# Altium project EM411-PROJ001.PrjPcb
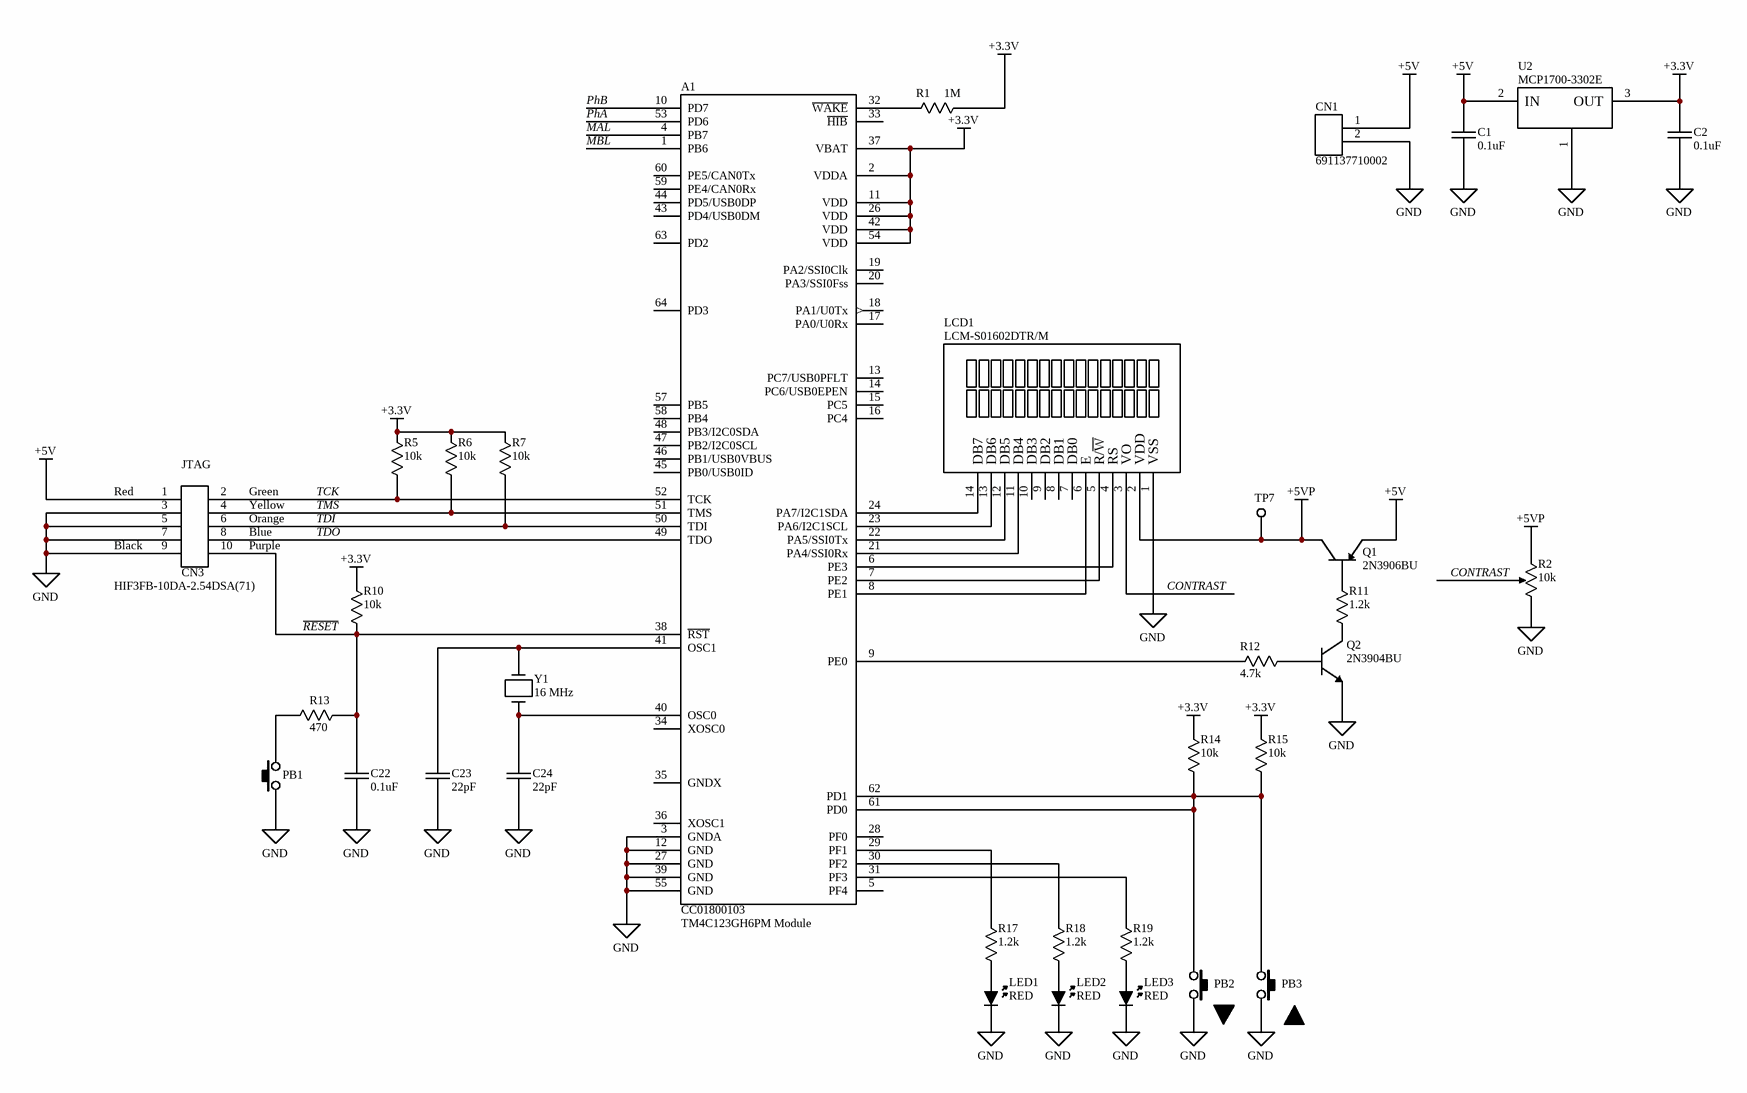
[diagram p0: Sheet1.SchDoc]
3 sheets, 96 parts. Net scope: global (net labels, ports and power ports of the same name join across sheets).
Board file: PCB1.PcbDoc
Sheets:
  Sheet1.SchDoc
  Sheet2.SchDoc
  Sheet3.SchDoc

## Sheet Sheet1.SchDoc: EM411-PROJ001
size A3; Date: March-25-2021; DrawnBy: Gaurav Daura; SheetNumber: 1; SheetTotal: 3

### Parts
A1  CC01800103  Microcontroller: TM4C123GH6PM Module  [CC01800102]
C1  0.1uF  [C320C104M5R5TA]
C2  0.1uF  [C320C104M5R5TA]
C22  0.1uF  [C320C104M5R5TA]
C23  22pF  [K220J15C0GF5TH5]
C24  22pF  [K220J15C0GF5TH5]
CN1  691137710002  [691137710002]
CN3  HIF3FB-10DA-2.54DSA(71)  [HIF3FB-10DA-2.54DSA(71)]
LCD1  LCM-S01602DTR/M  [LCM-S01602DTR/M]
LED1  RED  [C503B-RCN-CW0Z0AA1]
LED2  RED  [C503B-RCN-CW0Z0AA1]
LED3  RED  [C503B-RCN-CW0Z0AA1]
PB1  3-1825910-5  [3-1825910-5]  (value not drawn)
PB2  3-1825910-5  [3-1825910-5]  (value not drawn)
PB3  3-1825910-5  [3-1825910-5]  (value not drawn)
Q1  2N3906BU  [2N3906BU]
Q2  2N3904BU  [2N3904BU]
R1  1M  [1/2WattResistor]
R2  10k  [T93YA103KT20]
R5  10k  [1/2WattResistor]
R6  10k  [1/2WattResistor]
R7  10k  [1/2WattResistor]
R10  10k  [1/2WattResistor]
R11  1.2k  [1/2WattResistor]
R12  4.7k  [1/2WattResistor]
R13  470  [1/2WattResistor]
R14  10k  [1/2WattResistor]
R15  10k  [1/2WattResistor]
R17  1.2k  [1/2WattResistor]
R18  1.2k  [1/2WattResistor]
R19  1.2k  [1/2WattResistor]
TP7  TESTPOINT-2MM  [TESTPOINT-2MM]  (value not drawn)  (no BOM)
U2  MCP1700-3302E  [MCP1700-3302E/TO]
Y1  16 MHz  [ABL-16.000MHZ-B2]

### Nets
+3.3V: A1.2(VDDA) A1.11(VDD) A1.26(VDD) A1.37(VBAT) A1.42(VDD) A1.54(VDD) C2.2 R1.2 R5.2 R6.2 R7.2 R10.2 R14.2 R15.2 U2.3(OUT)
+5V: C1.2 CN1.1 CN3.1 Q1.1(E) U2.2(IN)
+5VP: LCD1.2(VDD) Q1.3(C) R2.1 TP7.1
GND: A1.3(GNDA) A1.12(GND) A1.27(GND) A1.39(GND) A1.55(GND) C1.1 C2.1 C22.2 C23.2 C24.2 CN1.2 CN3.3 CN3.5 CN3.7 CN3.9 LCD1.1(VSS) LED1.K LED2.K LED3.K PB1.1 PB2.2 PB3.2 Q2.1(E) R2.3 U2.1(GND)
CONTRAST: LCD1.3(VO) R2.2
MAL: A1.4(PB7)
MBL: A1.1(PB6)
PhA: A1.53(PD6)
PhB: A1.10(PD7)
~{RESET}: A1.38(~{RST}) C22.1 CN3.10 R10.1 R13.2
TCK: A1.52(TCK) CN3.2 R5.1
TDI: A1.50(TDI) CN3.6 R7.1
TDO: A1.49(TDO) CN3.8
TMS: A1.51(TMS) CN3.4 R6.1
NetA1_6: A1.6(PE3) LCD1.4(RS)
NetA1_7: A1.7(PE2) LCD1.5(R/~{W})
NetA1_8: A1.8(PE1) LCD1.6(E)
NetA1_9: A1.9(PE0) R12.1
NetA1_21: A1.21(PA4/SSI0Rx) LCD1.11(DB4)
NetA1_22: A1.22(PA5/SSI0Tx) LCD1.12(DB5)
NetA1_23: A1.23(PA6/I2C1SCL) LCD1.13(DB6)
NetA1_24: A1.24(PA7/I2C1SDA) LCD1.14(DB7)
NetA1_29: A1.29(PF1) R17.2
NetA1_30: A1.30(PF2) R18.2
NetA1_31: A1.31(PF3) R19.2
NetA1_32: A1.32(~{WAKE}) R1.1
NetA1_40: A1.40(OSC0) C24.1 Y1.1
NetA1_41: A1.41(OSC1) C23.1 Y1.2
NetA1_61: A1.61(PD0) A1.62(PD1) PB2.1 PB3.1 R14.1 R15.1
NetLED1_A: LED1.A R17.1
NetLED2_A: LED2.A R18.1
NetLED3_A: LED3.A R19.1
NetPB1_2: PB1.2 R13.1
NetQ1_2: Q1.2(B) R11.2
NetQ2_2: Q2.2(B) R12.2
NetQ2_3: Q2.3(C) R11.1

Not connected (* = marked no-connect by the designer): A1 5(PF4) 13(PC7/USB0PFLT) 14(PC6/USB0EPEN) 15(PC5) 16(PC4) 17(PA0/U0Rx) 18(PA1/U0Tx) 19(PA2/SSI0Clk) 20(PA3/SSI0Fss) 28(PF0) 33(~{HIB}) 34(XOSC0) 35(GNDX) 36(XOSC1) 43(PD4/USB0DM) 44(PD5/USB0DP) 45(PB0/USB0ID) 46(PB1/USB0VBUS) 47(PB2/I2C0SCL) 48(PB3/I2C0SDA) 57(PB5) 58(PB4) 59(PE4/CAN0Rx) 60(PE5/CAN0Tx) 63(PD2) 64(PD3); LCD1 7(DB0) 8(DB1) 9(DB2) 10(DB3)

### Notes on the sheet
- (near CN3) Red
- (near CN3) JTAG
- (near CN3) Green
- (near CN3) Black
- (near CN3) Yellow
- (near CN3) Orange
- (near CN3) Blue
- (near CN3) Purple
- Course
- EM 411 Embedded Systems Design
- Title
- Date
- Sheet
- of
- File
- Drawn by

### Library data of the parts
A1 = CC01800103: Tiva TM4C123GH6PM Microcontroller Module; Manufacturer: Confederation College; PartNumber: CC01800103
C1 C2 C22 = C320C104M5R5TA: 0.1 uF, 50 V Ceramic Capacitor; Manufacturer: Kemet; PartNumber: C320C104M5R5TA
C23 C24 = K220J15C0GF5TH5: 22 pF, 50 V Ceramic Capacitor; Manufacturer: Vishay; PartNumber: K220J15C0GF5TH5
CN1 = 691137710002: TERM BLK 2POS SIDE ENTRY 5MM PCB; Manufacturer: Wurth Elektronk; PartNumber: 691137710002
CN3 = HIF3FB-10DA-2.54DSA(71): CONN RCPT 10POS 0.1 GOLD PCB; Manufacturer: Hirose Electric Co, Ltd; PartNumber: HIF3FB-10DA-2.54DSA(71)
LCD1 = LCM-S01602DTR/M: 16x2 Character LCD Module, TN, Reflective; Manufacturer: Lumex, Inc.; PartNumber: LCM-S01602DTR/M
LED1-LED3 = C503B-RCN-CW0Z0AA1: 5 mm Red Round LED; Manufacturer: Cree, Inc.; PartNumber: C503B-RCN-CW0Z0AA1; Value: RED
PB1-PB3 = 3-1825910-5: SWITCH TACTILE SPST-NO 0.05A 24V; Manufacturer: TE Connectivity ALCOSWITCH Switches; PartNumber: 3-1825910-5
Q1 = 2N3906BU: PNP General Purpose Amplifier; Manufacturer: Fairchild Semiconductor Corporation; PartNumber: 2N3906BU; Value: PNP
Q2 = 2N3904BU: NPN General Purpose Amplifier; Manufacturer: Fairchild Semiconductor Corporation; PartNumber: 2N3904BU; Value: NPN
R1 = RES1M-500mW-THRU-HOLE: 1 Mega Ohm, ±5%, 0.5W Thru-Hole Resistor; Manufacturer: Generic; PartNumber: RES1k2-500mW-THRU-HOLE; Value: 1M
R2 = T93YA103KT20: 10 k, 21-Turn Trimmer; Manufacturer: Vishay Sfernice; PartNumber: T93YA103KT20; Value: 10k
R5-R7 R10 R14 R15 = RES10k-500mW-THRU-HOLE: 10k, ±5%, 0.5W Thru-Hole Resistor; Manufacturer: Generic; PartNumber: RES10k-500mW-THRU-HOLE; Value: 10k
R11 R17-R19 = RES1k2-500mW-THRU-HOLE: 1.2k, ±5%, 0.5W Thru-Hole Resistor; Manufacturer: Generic; PartNumber: RES1k2-500mW-THRU-HOLE; Value: 1.2k
R12 = RES4k7-500mW-THRU-HOLE: 4.7 kOhm, ±5%, 0.5W Thru-Hole Resistor; Manufacturer: Generic; PartNumber: RES4k7-500mW-THRU-HOLE; Value: 4.7k
R13 = RES470-500mW-THRU-HOLE: 470 Ohm, ±5%, 0.5W Thru-Hole Resistor; Manufacturer: Generic; PartNumber: RES470-500mW-THRU-HOLE; Value: 470
TP7 = TESTPOINT-2MM: Test Point 2MM diameter; Manufacturer: -; PartNumber: -
U2 = MCP1700-3302E: Low Quiescent Current LDO; Manufacturer: Microchip Technology; PartNumber: MCP1700-3302E
Y1 = ABL-16.000MHZ-B2: 16 MHz AC/49US (AT49) Microprocessor Crystall; Manufacturer: Abracon Corporation; PartNumber: ABL-16.000MHZ-B2

## Sheet Sheet2.SchDoc: EM411-PROJ001
size A3; Date: March-25-2021; DrawnBy: Gaurav Daura; SheetNumber: 2; SheetTotal: 3
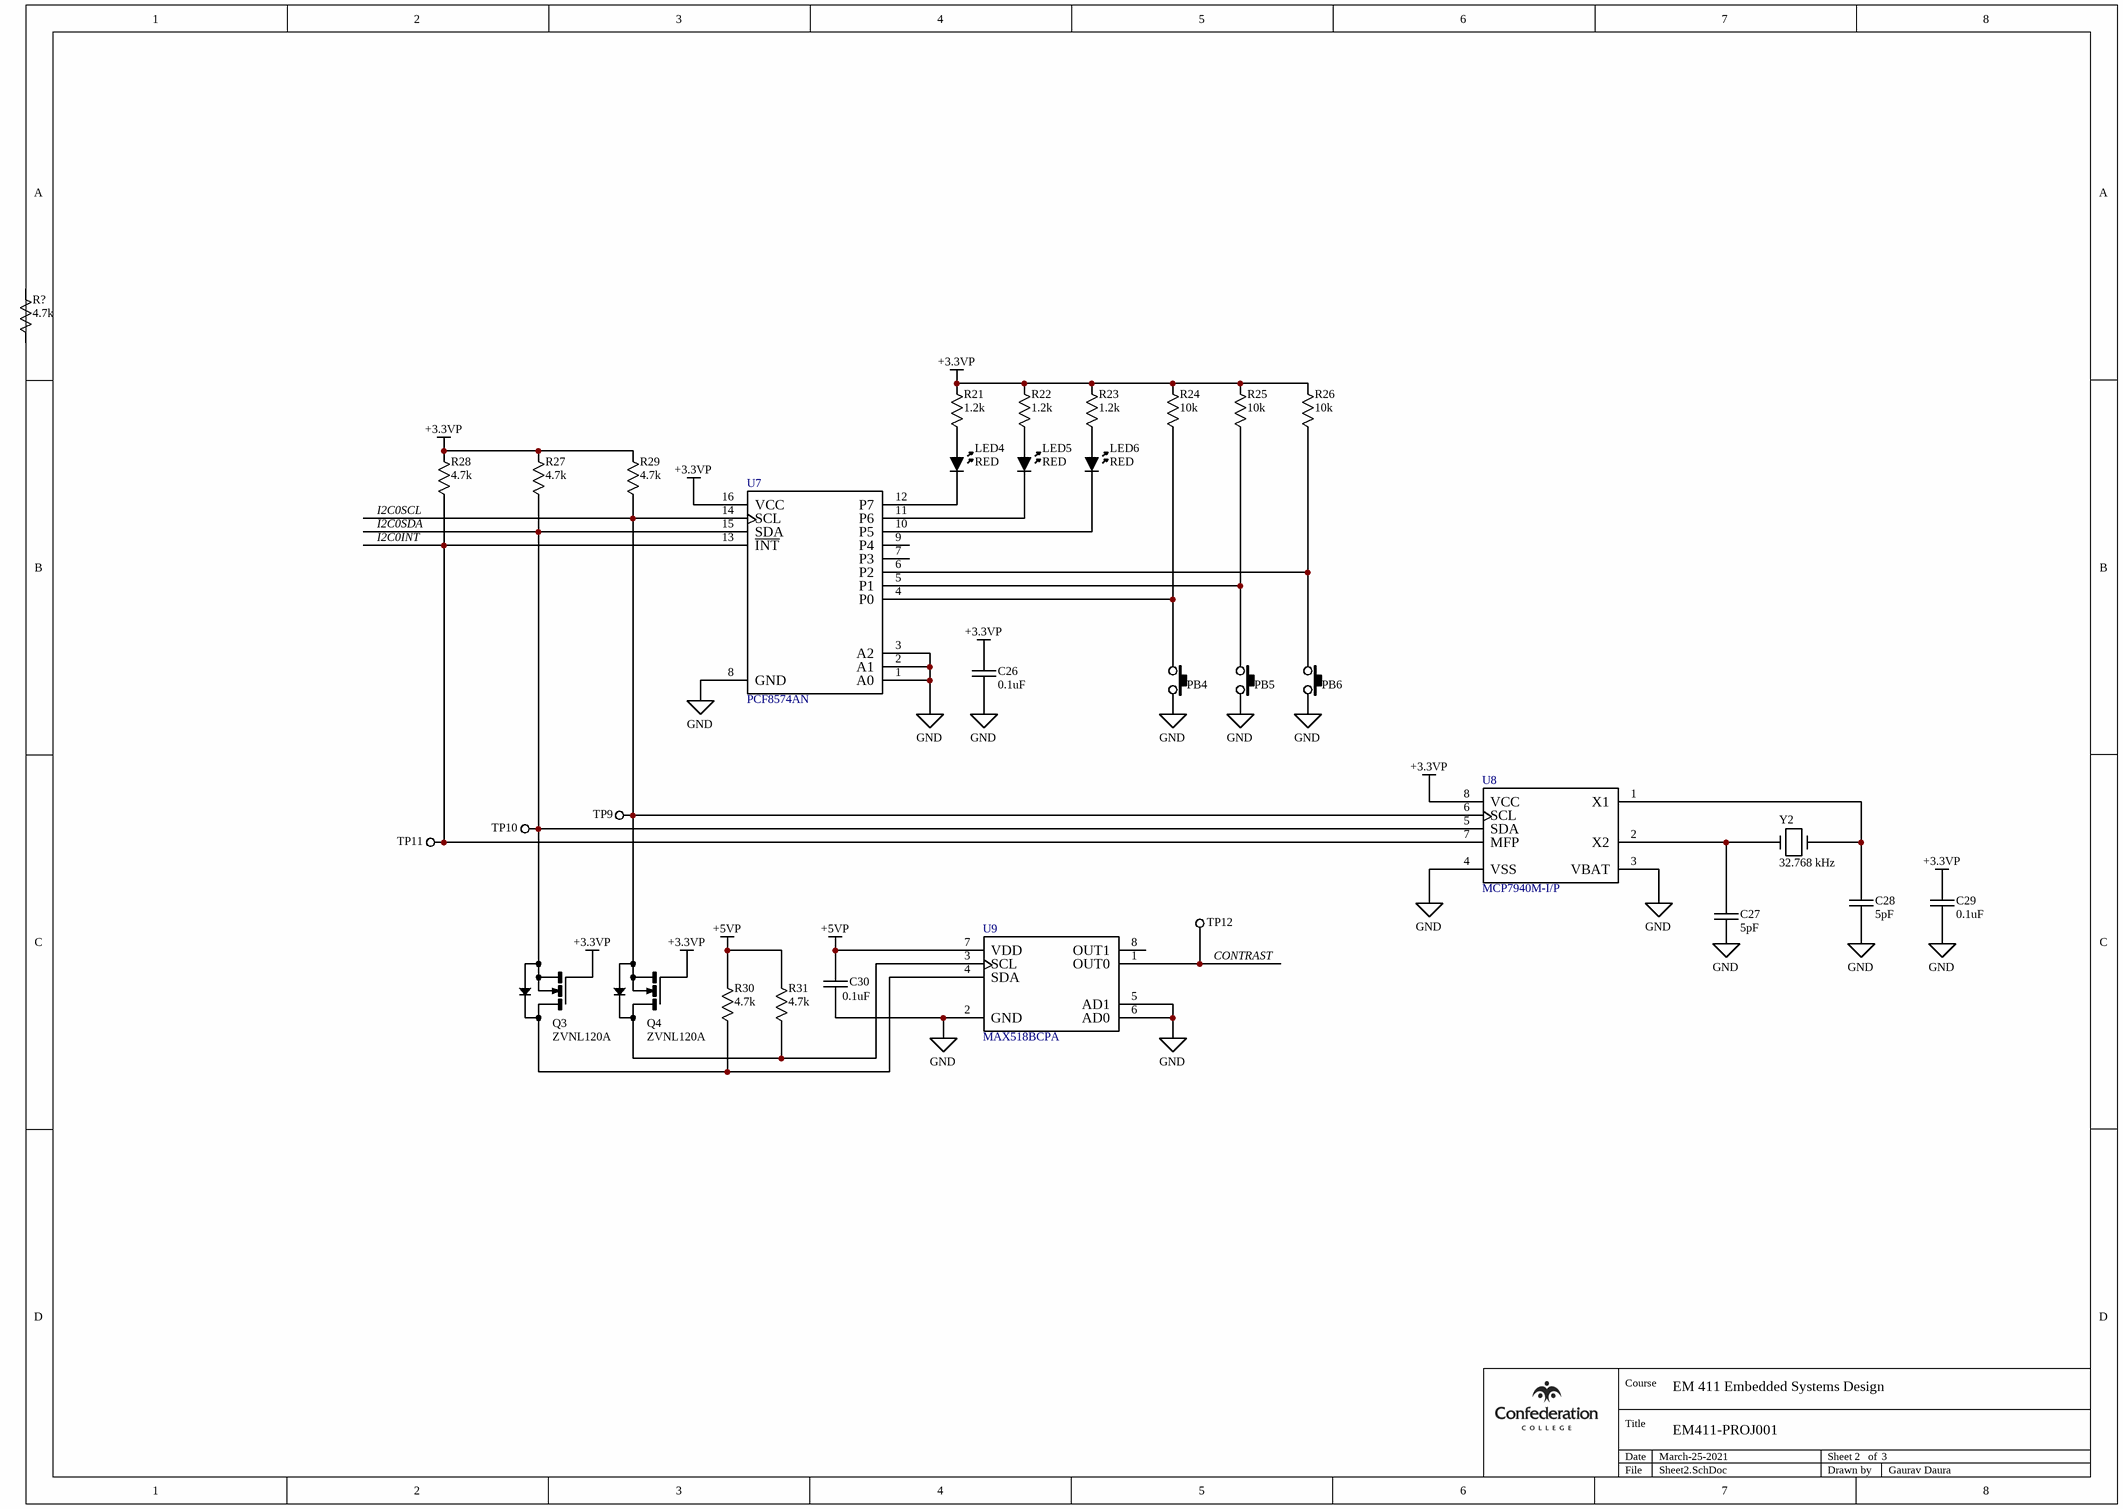
[diagram p1: Sheet2.SchDoc]

### Parts
C26  0.1uF  [C320C104M5R5TA]
C27  5pF  [RCE5C1H5R0C0M1H03A]
C28  5pF  [RCE5C1H5R0C0M1H03A]
C29  0.1uF  [C320C104M5R5TA]
C30  0.1uF  [C320C104M5R5TA]
LED4  RED  [C503B-RCN-CW0Z0AA1]
LED5  RED  [C503B-RCN-CW0Z0AA1]
LED6  RED  [C503B-RCN-CW0Z0AA1]
PB4  3-1825910-5  [3-1825910-5]  (value not drawn)
PB5  3-1825910-5  [3-1825910-5]  (value not drawn)
PB6  3-1825910-5  [3-1825910-5]  (value not drawn)
Q3  ZVNL120A  [ZVNL120A]
Q4  ZVNL120A  [ZVNL120A]
R21  1.2k  [1/2WattResistor]
R22  1.2k  [1/2WattResistor]
R23  1.2k  [1/2WattResistor]
R24  10k  [1/2WattResistor]
R25  10k  [1/2WattResistor]
R26  10k  [1/2WattResistor]
R27  4.7k  [1/2WattResistor]
R28  4.7k  [1/2WattResistor]
R29  4.7k  [1/2WattResistor]
R30  4.7k  [1/2WattResistor]
R31  4.7k  [1/2WattResistor]
R?  4.7k  [1/2WattResistor]
TP9  TESTPOINT-2MM  [TESTPOINT-2MM]  (value not drawn)  (no BOM)
TP10  TESTPOINT-2MM  [TESTPOINT-2MM]  (value not drawn)  (no BOM)
TP11  TESTPOINT-2MM  [TESTPOINT-2MM]  (value not drawn)  (no BOM)
TP12  TESTPOINT-2MM  [TESTPOINT-2MM]  (value not drawn)  (no BOM)
U7  PCF8574AN  [PCF8574AN]
U8  MCP7940M-I/P  [MCP7940M-I/P]
U9  MAX518BCPA  [MAX518BCPA]
Y2  32.768 kHz  [CFS-20632768EZBB]

### Nets
+3.3VP: C26.1 C29.1 Q3.2 Q4.2 R21.2 R22.2 R23.2 R24.2 R25.2 R26.2 R27.2 R28.2 R29.2 U7.16(VCC) U8.8(VCC)
+5VP: C30.2 R30.2 R31.2 U9.7(VDD)
GND: C26.2 C27.2 C28.2 C29.2 C30.1 PB4.2 PB5.2 PB6.2 U7.1(A0) U7.2(A1) U7.3(A2) U7.8(GND) U8.3(VBAT) U8.4(VSS) U9.2(GND) U9.5(AD1) U9.6(AD0)
CONTRAST: TP12.1 U9.1(OUT0)
I2C0INT: R28.1 TP11.1 U7.13(~{INT}) U8.7(MFP)
I2C0SCL: Q4.1 R29.1 TP9.1 U7.14(SCL) U8.6(SCL)
I2C0SDA: Q3.1 R27.1 TP10.1 U7.15(SDA) U8.5(SDA)
NetC27_1: C27.1 U8.2(X2) Y2.2
NetC28_1: C28.1 U8.1(X1) Y2.1
NetLED4_A: LED4.A R21.1
NetLED4_K: LED4.K U7.12(P7)
NetLED5_A: LED5.A R22.1
NetLED5_K: LED5.K U7.11(P6)
NetLED6_A: LED6.A R23.1
NetLED6_K: LED6.K U7.10(P5)
NetPB4_1: PB4.1 R24.1 U7.4(P0)
NetPB5_1: PB5.1 R25.1 U7.5(P1)
NetPB6_1: PB6.1 R26.1 U7.6(P2)
NetQ3_3: Q3.3 R30.1 U9.4(SDA)
NetQ4_3: Q4.3 R31.1 U9.3(SCL)

Not connected (* = marked no-connect by the designer): R? 1 2; U7 7(P3) 9(P4); U9 8(OUT1)

### Notes on the sheet
- Course
- EM 411 Embedded Systems Design
- Title
- Date
- Sheet
- of
- File
- Drawn by

### Library data of the parts
C26 C29 C30 = C320C104M5R5TA: as C1 on sheet Sheet1; PartNumber: C320C104M5R5TA
C27 C28 = RCE5C1H5R0C0M1H03A: 5 pF, 50 V Ceramic Capacitor; Manufacturer: Murata Electronics North America; PartNumber: RCE5C1H5R0C0M1H03A
LED4-LED6 = C503B-RCN-CW0Z0AA1: as LED1 on sheet Sheet1; PartNumber: C503B-RCN-CW0Z0AA1; Value: RED
PB4-PB6 = 3-1825910-5: as PB1 on sheet Sheet1; PartNumber: 3-1825910-5
Q3 Q4 = ZVNL120A: 25V, 31 A, N-Channel Power MOSFET; Manufacturer: Diodes Inc; PartNumber: ZVNL120A
R21-R23 = RES1k2-500mW-THRU-HOLE: as R11 on sheet Sheet1; PartNumber: RES1k2-500mW-THRU-HOLE; Value: 1.2k
R24-R26 = RES10k-500mW-THRU-HOLE: as R5 on sheet Sheet1; PartNumber: RES10k-500mW-THRU-HOLE; Value: 10k
R27-R31 R? = RES4k7-500mW-THRU-HOLE: as R12 on sheet Sheet1; PartNumber: RES4k7-500mW-THRU-HOLE; Value: 4.7k
TP9-TP12 = TESTPOINT-2MM: Test Point 2MM diameter; Manufacturer: -; PartNumber: -
U7 = PCF8574AN: Remote 8-Bit I/O Expander for I2C Bus; Manufacturer: Texas Instruments Inc.; PartNumber: PCF8574AN
U8 = MCP7940M-I/P: Clock and Calendar with 64-Byte SRAM; Manufacturer: Microchip Technology; PartNumber: MCP7940M-I/P
U9 = MAX518BCPA: 2-Wire Serial 8-Bit DACs with Rail-to-Rail Outputs; Manufacturer: Maxim Integrated Products; PartNumber: MAX518BCPA
Y2 = CFS-20632768EZBB: 32.768 kHz Tuning Fork (Cylinder Type, 6 pF); Manufacturer: Citizen; PartNumber: CFS-20632768EZBB

## Sheet Sheet3.SchDoc: EM411-PROJ001
size A3; Date: March-25-2021; DrawnBy: Gaurav Daura; SheetNumber: 3; SheetTotal: 3
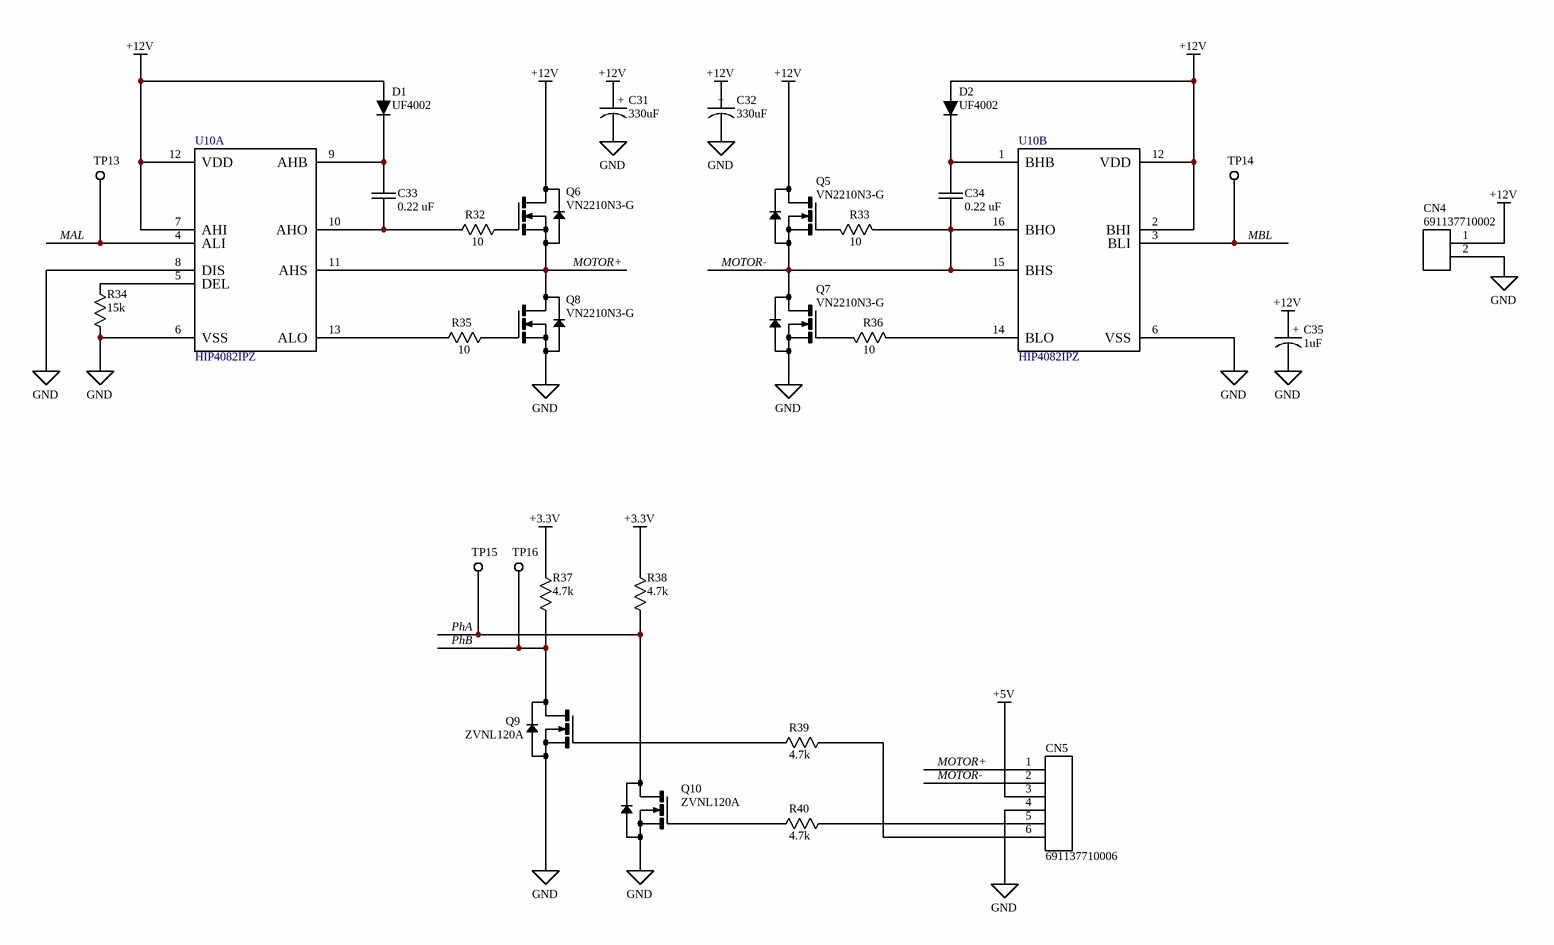
[diagram p2: Sheet3.SchDoc]

### Parts
C31  330uF  [ECA-1EM331]
C32  330uF  [ECA-1EM331]
C33  0.22 uF  [C330C224K1R5TA7301]
C34  0.22 uF  [C330C224K1R5TA7301]
C35  1uF  [SR215E105MAR]
CN4  691137710002  [691137710002]
CN5  691137710006  [691137710006]
D1  UF4002  [UF4002]
D2  UF4002  [UF4002]
Q5  VN2210N3-G  [VN2210N3-G]
Q6  VN2210N3-G  [VN2210N3-G]
Q7  VN2210N3-G  [VN2210N3-G]
Q8  VN2210N3-G  [VN2210N3-G]
Q9  ZVNL120A  [ZVNL120A]
Q10  ZVNL120A  [ZVNL120A]
R32  10  [1/2WattResistor]
R33  10  [1/2WattResistor]
R34  15k  [1/2WattResistor]
R35  10  [1/2WattResistor]
R36  10  [1/2WattResistor]
R37  4.7k  [1/2WattResistor]
R38  4.7k  [1/2WattResistor]
R39  4.7k  [1/2WattResistor]
R40  4.7k  [1/2WattResistor]
TP13  TESTPOINT-2MM  [TESTPOINT-2MM]  (value not drawn)  (no BOM)
TP14  TESTPOINT-2MM  [TESTPOINT-2MM]  (value not drawn)  (no BOM)
TP15  TESTPOINT-2MM  [TESTPOINT-2MM]  (value not drawn)  (no BOM)
TP16  TESTPOINT-2MM  [TESTPOINT-2MM]  (value not drawn)  (no BOM)
U10  HIP4082IPZ  [HIP4082IPZ]  (parts A,B of 2)

### Nets
+3.3V: R37.2 R38.2
+5V: CN5.3
+12V: C31.1 C32.1 C35.1 CN4.1 D1.A D2.A Q5.3 Q6.3 U10.2(BHI) U10.7(AHI) U10.12(VDD)
GND: C31.2 C32.2 C35.2 CN4.2 CN5.4 Q7.1 Q8.1 Q9.1 Q10.1 R34.1 U10.6(VSS) U10.8(DIS)
MAL: TP13.1 U10.4(ALI)
MBL: TP14.1 U10.3(BLI)
MOTOR+: CN5.1 Q6.1 Q8.3 U10.11(AHS)
MOTOR-: C34.2 CN5.2 Q5.1 Q7.3 R33.1 U10.15(BHS) U10.16(BHO)
PhA: Q10.3 R38.1 TP15.1
PhB: Q9.3 R37.1 TP16.1
NetC33_1: C33.1 D1.K U10.9(AHB)
NetC33_2: C33.2 R32.1 U10.10(AHO)
NetC34_1: C34.1 D2.K U10.1(BHB)
NetCN5_5: CN5.5 R40.2
NetCN5_6: CN5.6 R39.2
NetQ5_2: Q5.2 R33.2
NetQ6_2: Q6.2 R32.2
NetQ7_2: Q7.2 R36.2
NetQ8_2: Q8.2 R35.2
NetQ9_2: Q9.2 R39.1
NetQ10_2: Q10.2 R40.1
NetR34_2: R34.2 U10.5(DEL)
NetR35_1: R35.1 U10.13(ALO)
NetR36_1: R36.1 U10.14(BLO)

### Notes on the sheet
- Course
- EM 411 Embedded Systems Design
- Title
- Date
- Sheet
- of
- File
- Drawn by
- (in symbol ECA-1EM331) +
- (in symbol SR215E105MAR) +

### Library data of the parts
C31 C32 = ECA-1EM331: 330 uF, 25 V Aluminum Electrolytic Capacitor; Manufacturer: Panasonic Corporation of North America; PartNumber: ECA-1EM331
C33 C34 = C330C224K1R5TA7301: 0.22 uF, 100 V Ceramic Capacitor; Manufacturer: Kemet; PartNumber: C330C224K1R5TA7301
C35 = SR215E105MAR: 1 uF, 50 V Ceramic Capacitor; Manufacturer: AVX Corporation; PartNumber: SR215E105MAR
CN4 = 691137710002: as CN1 on sheet Sheet1; PartNumber: 691137710002
CN5 = 691137710006: TERM BLK 6POS SIDE ENTRY 5MM PCB; Manufacturer: Wurth Elektronik; PartNumber: 691137710006
D1 D2 = UF4002: Fast Rectifier; Manufacturer: ON Semiconductor; PartNumber: UF4002
Q5-Q8 = VN2210N3-G: N-Channel Enhancement-Mode Vertical DMOS FETs; Manufacturer: Supertex Inc.; PartNumber: VN2210N3-G
Q9 Q10 = ZVNL120A: as Q3 on sheet Sheet2; PartNumber: ZVNL120A
R32 R33 R35 R36 = RES10-500mW-THRU-HOLE: 10 Ohmn, ±5%, 0.5W Thru-Hole Resistor; Manufacturer: Generic; PartNumber: RES10-500mW-THRU-HOLE; Value: 10
R34 = RES15k-500mW-THRU-HOLE: 15 kOhm, ±5%, 0.5W Thru-Hole Resistor; Manufacturer: Generic; PartNumber: RES15k-500mW-THRU-HOLE; Value: 15k
R37-R40 = RES4k7-500mW-THRU-HOLE: as R12 on sheet Sheet1; PartNumber: RES4k7-500mW-THRU-HOLE; Value: 4.7k
TP13-TP16 = TESTPOINT-2MM: Test Point 2MM diameter; Manufacturer: -; PartNumber: -
U10 = HIP4082IPZ: 80V, 1.25A Peak Current H-Bridge FET Driver; Manufacturer: Renesas; PartNumber: HIP4082IPZ

## Nets that join several sheets
+3.3V: Sheet1 (15 pins), Sheet3 (R37.2 R38.2)
+5V: Sheet1 (5 pins), Sheet3 (CN5.3)
+5VP: Sheet1 (LCD1.2 Q1.3 R2.1 TP7.1), Sheet2 (C30.2 R30.2 R31.2 U9.7)
GND: Sheet1 (25 pins), Sheet2 (17 pins), Sheet3 (12 pins)
CONTRAST: Sheet1 (LCD1.3 R2.2), Sheet2 (TP12.1 U9.1)
MAL: Sheet1 (A1.4), Sheet3 (TP13.1 U10.4)
MBL: Sheet1 (A1.1), Sheet3 (TP14.1 U10.3)
PhA: Sheet1 (A1.53), Sheet3 (Q10.3 R38.1 TP15.1)
PhB: Sheet1 (A1.10), Sheet3 (Q9.3 R37.1 TP16.1)